# Altium schematic sheet GH125-S02DCA-001_GH125-S02DCA-00.schdoc.schdoc
size 127 x 99 mm
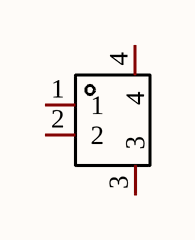
[diagram p0: GH125-S02DCA-001_GH125-S02DCA-00.schdoc.schdoc]

## Parts
X?  GH125-S02DCA-00  [CONN-SMD_2P-P1.25_JUSHUO_GH125-S02DCA-00]  (value not drawn)

## Nets

Not connected (* = marked no-connect by the designer): X? 1 2 3 4

## Library data of the parts
X? = GH125-S02DCA-00: Manufacturer: JS(钜硕电子); Add into BOM: yes; Pins Structure: 1x2P; Pitch: 1.25mm; Number of PINs Per Row: 2; Current Rating (Max): 1A; Symbol: GH125-S02DCA-00; Device: GH125-S02DCA-00; Supplier: LCSC; Supplier Part: C2886765; Manufacturer Part: GH125-S02DCA-00; JLCPCB Part Class: Extended Part; LCSC Part Name: 1x2P 间距:1.25mm 卧贴 带扣; Supplier Footprint: SMD,P=1.25mm; Datasheet: https://atta.szlcsc.com/upload/public/pdf/source/20210818/CD11791E5ED3EDF45A7009E9C8A2BD4C.pdf; Convert to PCB: yes; Mounting Style: 卧贴; Row Spacing: -; Number of Pins: 2P; Number of Rows: 1; Reference Series: -; Operating Temperature Range: -25℃~+85℃